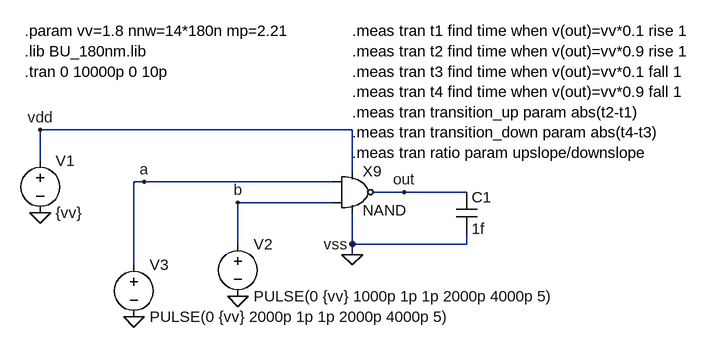
[diagram p0: schematic nand_test.asc]
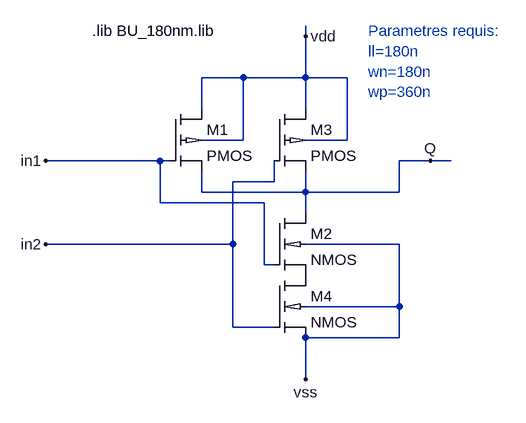
[diagram p1: sub-circuit nand.asc]
nand_test.asc, the LTspice schematic file:
Version 4
SHEET 1 1168 680
WIRE 416 224 -64 224
WIRE -64 272 -64 224
WIRE 416 288 416 224
WIRE 96 304 80 304
WIRE 384 304 96 304
WIRE 496 320 448 320
WIRE 592 320 496 320
WIRE 384 336 240 336
WIRE 240 400 240 336
WIRE 416 400 416 352
WIRE 592 400 592 384
WIRE 592 400 416 400
WIRE 416 416 416 400
WIRE 80 432 80 304
FLAG -64 352 0
FLAG 240 480 0
FLAG 416 416 0
FLAG -64 224 vdd
FLAG 416 400 vss
FLAG 240 336 b
FLAG 496 320 out
FLAG 80 512 0
FLAG 96 304 a
SYMBOL /voltage -64 256 R0
SYMATTR InstName V1
SYMATTR Value {vv}
SYMBOL /voltage 240 384 R0
SYMATTR InstName V2
SYMATTR Value PULSE(0 {vv} 1000p 1p 1p 2000p 4000p 5)
SYMBOL nand 416 320 R0
SYMATTR InstName X9
SYMATTR SpiceLine ll=180n wn={nnw} wp={nnw*mp}
SYMBOL /voltage 80 416 R0
SYMATTR InstName V3
SYMATTR Value PULSE(0 {vv} 2000p 1p 1p 2000p 4000p 5)
SYMBOL cap 576 320 R0
SYMATTR InstName C1
SYMATTR Value 1f
TEXT -88 72 Left 2 !.param vv=1.8 nnw=14*180n mp=2.21\n.lib BU_180nm.lib\n.tran 0 10000p 0 10p
TEXT 416 72 Left 2 !.meas tran t1 find time when v(out)=vv*0.1 rise 1\n.meas tran t2 find time when v(out)=vv*0.9 rise 1\n.meas tran t3 find time when v(out)=vv*0.1 fall 1\n.meas tran t4 find time when v(out)=vv*0.9 fall 1\n.meas tran transition_up param abs(t2-t1)\n.meas tran transition_down param abs(t4-t3)\n.meas tran ratio param upslope/downslope

nand.asc, the sub-circuit schematic file:
Version 4
SHEET 1 1192 788
WIRE 448 176 448 160
WIRE 352 240 288 240
WIRE 448 240 448 176
WIRE 448 240 352 240
WIRE 512 240 448 240
WIRE 288 288 288 240
WIRE 448 288 448 240
WIRE 352 336 352 240
WIRE 352 336 288 336
WIRE 512 336 512 240
WIRE 512 336 448 336
WIRE 224 368 48 368
WIRE 240 368 224 368
WIRE 640 368 592 368
WIRE 672 368 640 368
WIRE 400 400 400 368
WIRE 400 400 336 400
WIRE 288 416 288 384
WIRE 448 416 448 384
WIRE 448 416 288 416
WIRE 592 416 592 368
WIRE 592 416 448 416
WIRE 224 432 224 368
WIRE 384 432 224 432
WIRE 448 448 448 416
WIRE 336 496 336 400
WIRE 336 496 48 496
WIRE 592 496 448 496
WIRE 384 528 384 432
WIRE 400 528 384 528
WIRE 592 592 592 496
WIRE 592 592 448 592
WIRE 336 624 336 496
WIRE 400 624 336 624
WIRE 592 640 592 592
WIRE 592 640 448 640
WIRE 448 704 448 640
FLAG 448 176 vdd
FLAG 448 704 vss
FLAG 640 368 Q
FLAG 48 368 in1
FLAG 48 496 in2
SYMBOL pmos018 240 288 R0
SYMATTR InstName M1
SYMATTR Value2 l={ll} w={wp} ad={450n*{wp}} as={450n*{wp}} pd={900n+{wp}} ps={1080n+{wp}}
SYMBOL nmos018 400 448 R0
SYMATTR InstName M2
SYMATTR Value2 l={ll} w={wn} ad={450n*{wn}} as={450n*{wn}} pd={900n+{wn}} ps={1080n+{wn}}
SYMBOL pmos018 400 288 R0
SYMATTR InstName M3
SYMATTR Value2 l={ll} w={wp} ad={450n*{wp}} as={450n*{wp}} pd={900n+{wp}} ps={1080n+{wp}}
SYMBOL nmos018 400 544 R0
SYMATTR InstName M4
SYMATTR Value2 l={ll} w={wn} ad={450n*{wn}} as={450n*{wn}} pd={900n+{wn}} ps={1080n+{wn}}
TEXT 120 168 Left 2 !.lib BU_180nm.lib
TEXT 544 168 Left 2 ;Parametres requis: \nll=180n\nwn=180n \nwp=360n

The netlist it stands for:
* nand_test.asc
V1 vdd 0 {vv}
V2 b 0 PULSE(0 {vv} 1000p 1p 1p 2000p 4000p 5)
XX9 a out vdd 0 b nand params: NAND ll=180n wn={nnw} wp={nnw*mp}
V3 a 0 PULSE(0 {vv} 2000p 1p 1p 2000p 4000p 5)
C1 out 0 1f

* block symbol definitions
.subckt nand in1 Q vdd vss in2
M1 vdd in1 Q vdd PMOS l={ll} w={wp} ad={450n*{wp}} as={450n*{wp}} pd={900n+{wp}} ps={1080n+{wp}}
M2 Q in1 P001 vss NMOS l={ll} w={wn} ad={450n*{wn}} as={450n*{wn}} pd={900n+{wn}} ps={1080n+{wn}}
M3 vdd in2 Q vdd PMOS l={ll} w={wp} ad={450n*{wp}} as={450n*{wp}} pd={900n+{wp}} ps={1080n+{wp}}
M4 P001 in2 vss vss NMOS l={ll} w={wn} ad={450n*{wn}} as={450n*{wn}} pd={900n+{wn}} ps={1080n+{wn}}
.lib BU_180nm.lib
* Parametres requis:
* ll=180n
* wn=180n
* wp=360n
.ends nand

.model NMOS NMOS
.model PMOS PMOS
.lib standard.mos
.param vv=1.8 nnw=14*180n mp=2.21
.lib BU_180nm.lib
.tran 0 10000p 0 10p
.meas tran t1 find time when v(out)=vv*0.1 rise 1
.meas tran t2 find time when v(out)=vv*0.9 rise 1
.meas tran t3 find time when v(out)=vv*0.1 fall 1
.meas tran t4 find time when v(out)=vv*0.9 fall 1
.meas tran transition_up param abs(t2-t1)
.meas tran transition_down param abs(t4-t3)
.meas tran ratio param upslope/downslope
.lib BU_180nm.lib
.backanno
.end

* Results of the author's LTspice run, read from the files saved beside the schematic
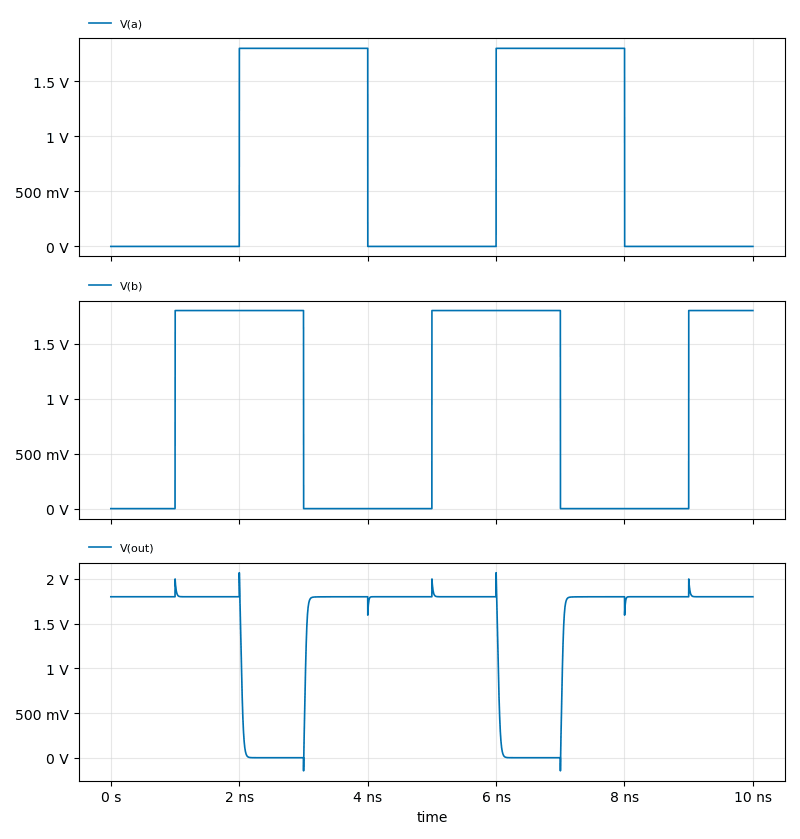
[diagram p2: Transient Analysis of nand_test.asc, plotted from the saved traces]
* Transient Analysis, 1 run:
*   V(a): min 0 V, max 1.8 V, average 720.4 mV, rms 1.139 V, last 0 V
*   V(b): min 0 V, max 1.8 V, average 900.3 mV, rms 1.273 V, last 1.8 V
*   V(out): min -146.5 mV, max 2.069 V, average 1.444 V, rms 1.607 V, last 1.8 V
* From the log:
*   t1: time=3.00951e-009 at 3.00951e-009
*   t2: time=3.06494e-009 at 3.06494e-009
*   t3: time=2.07678e-009 at 2.07678e-009
*   t4: time=2.01536e-009 at 2.01536e-009
*   transition_up: abs(t2-t1)=5.54259e-011
*   transition_down: abs(t4-t3)=6.14146e-011
*   Measurement "ratio" FAIL'ed